# EAGLE design a101-fader (EAGLE 7.5.1)
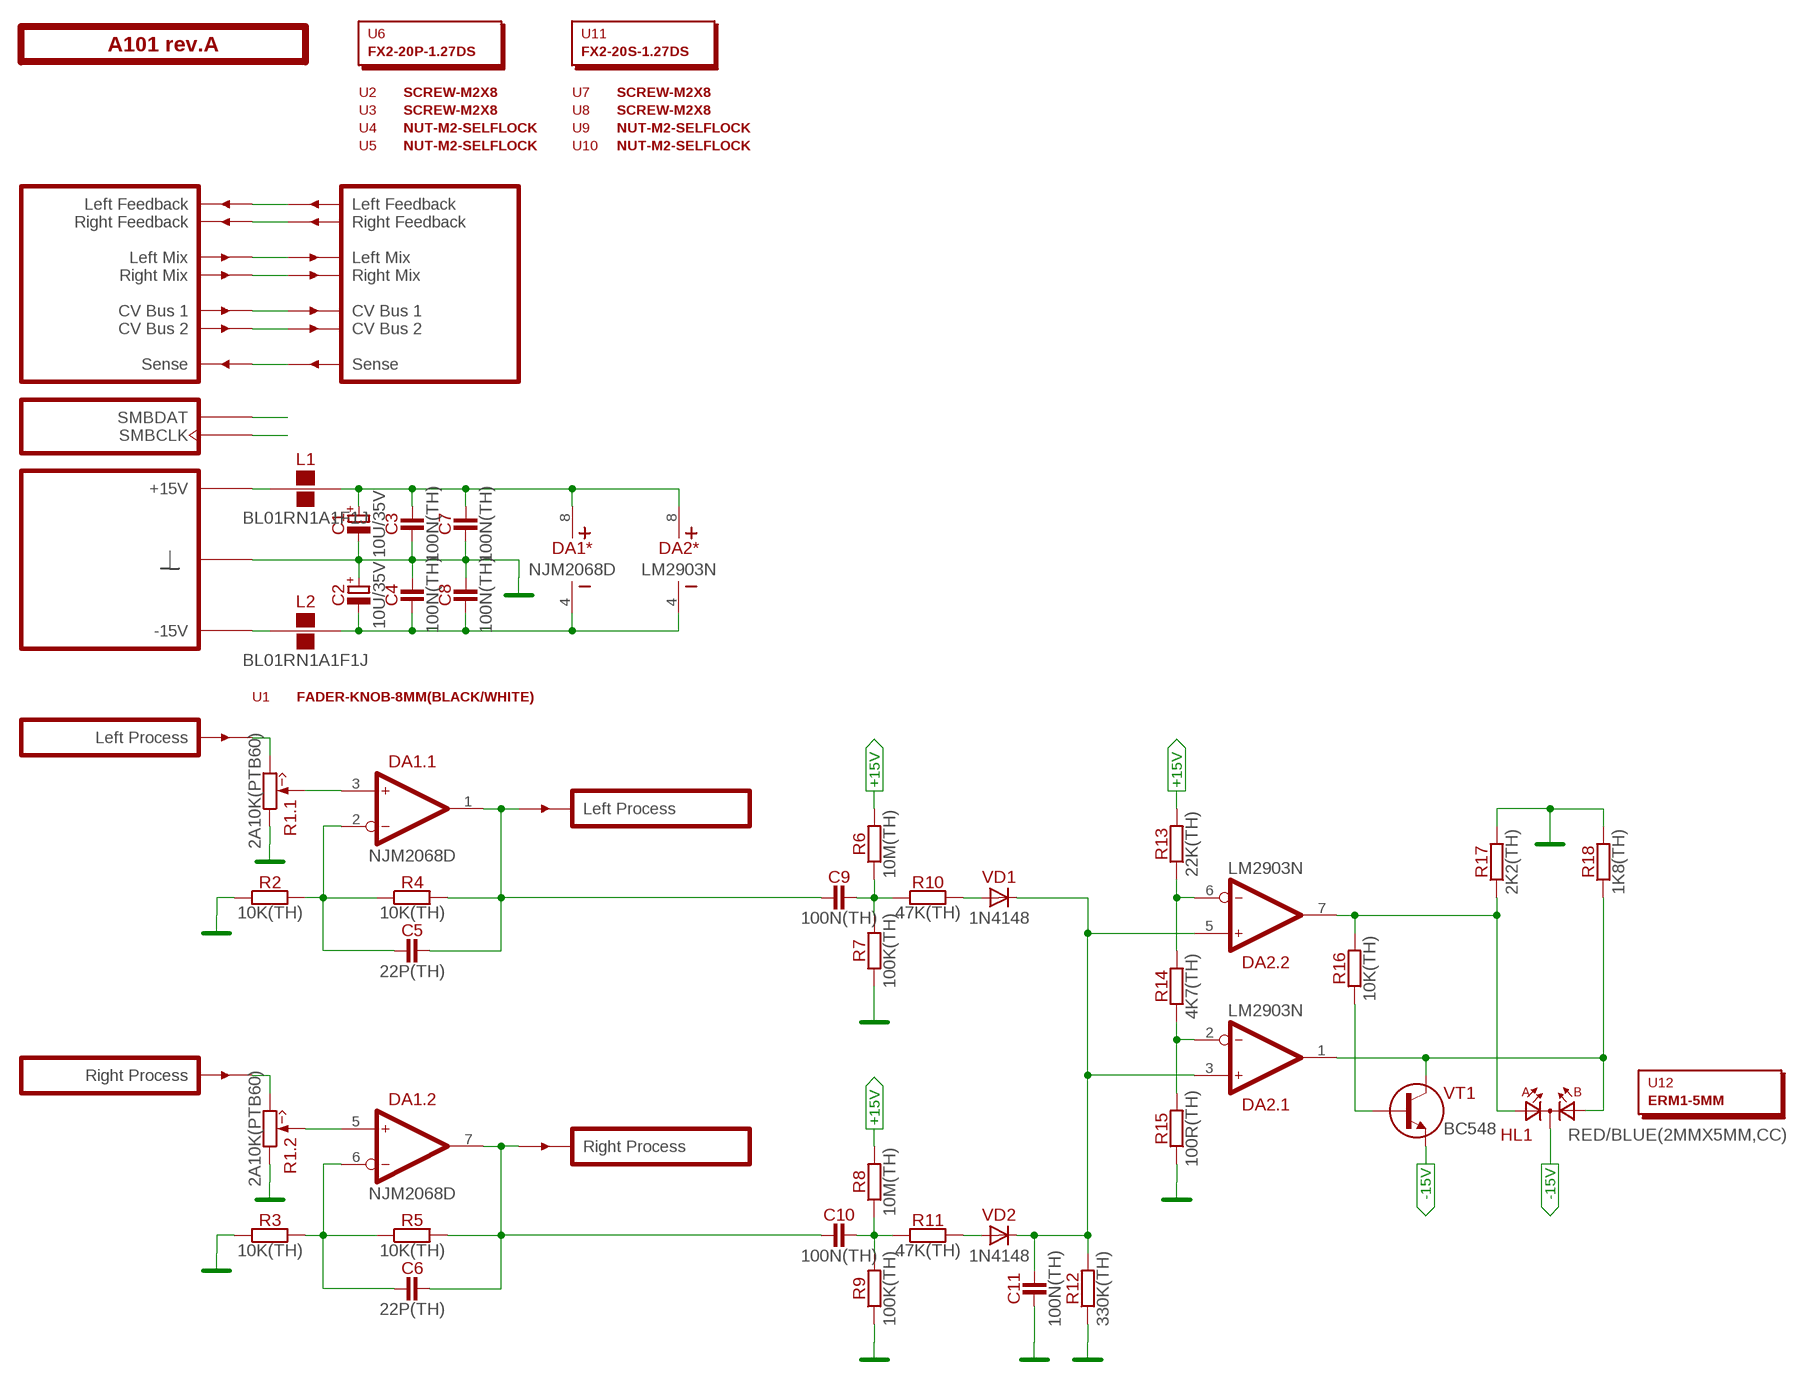
[diagram p0: schematic, sheet 1]

## Parts
C1  10U/35V  [E2-5]
C2  10U/35V  [E2-5]
C3  100N(TH)  [C050-024X044]
C4  100N(TH)  [C050-024X044]
C5  22P(TH)  [C050-024X044]
C6  22P(TH)  [C050-024X044]
C7  100N(TH)  [C050-024X044]
C8  100N(TH)  [C050-024X044]
C9  100N(TH)  [C050-024X044]
C10  100N(TH)  [C050-024X044]
C11  100N(TH)  [C050-024X044]
DA1  NJM2068D  [DIP-8]
DA2  LM2903N  [DIP-8]
HL1  RED/BLUE(2MMX5MM,CC)  [LED2X5-3PIN]
L1  BL01RN1A1F1J  [BL01RN1A]
L2  BL01RN1A1F1J  [BL01RN1A]
PCB1  A101 rev.A  ST2-BOARD-50  [ST2-BOARD-50]
R1  2A10K(PTB60)  [PTB6044]
R2  10K(TH)  [R-0207/10]
R3  10K(TH)  [R-0207/10]
R4  10K(TH)  [R-0207/10]
R5  10K(TH)  [R-0207/10]
R6  10M(TH)  [R-0207/10]
R7  100K(TH)  [R-0207/10]
R8  10M(TH)  [R-0207/10]
R9  100K(TH)  [R-0207/10]
R10  47K(TH)  [R-0207/10]
R11  47K(TH)  [R-0207/10]
R12  330K(TH)  [R-0207/10]
R13  22K(TH)  [R-0207/10]
R14  4K7(TH)  [R-0207/10]
R15  100R(TH)  [R-0207/10]
R16  10K(TH)  [R-0207/10]
R17  2K2(TH)  [R-0207/10]
R18  1K8(TH)  [R-0207/10]
U1  FADER-KNOB-8MM(BLACK/WHITE)  [EMPTY]
U2  SCREW-M2X8  [EMPTY]
U3  SCREW-M2X8  [EMPTY]
U4  NUT-M2-SELFLOCK  [EMPTY]
U5  NUT-M2-SELFLOCK  [EMPTY]
U6  FX2-20P-1.27DS  [EMPTY]
U7  SCREW-M2X8  [EMPTY]
U8  SCREW-M2X8  [EMPTY]
U9  NUT-M2-SELFLOCK  [EMPTY]
U10  NUT-M2-SELFLOCK  [EMPTY]
U11  FX2-20S-1.27DS  [EMPTY]
U12  ERM1-5MM  [EMPTY]
VD1  1N4148  [DO35-7]
VD2  1N4148  [DO35-7]
VT1  BC548  [TO92]

## Nets
+15V [power]: R6.2 R8.2 R13.2
-15V: HL1.K VT1.3(E)
GND: C1.- C2.+ C3.1 C4.2 C7.1 C8.2 C11.1 PCB1.B4'(GND) PCB1.B4(GND) PCB1.B5'(GND) PCB1.B5(GND) PCB1.B6'(GND) PCB1.B6(GND) PCB1.B7'(GND) PCB1.B7(GND) PCB1.B8'(GND) PCB1.B8(GND) R1.A1(.1:CCW) R1.B1(.2:CCW) R2.1 R3.1 R7.1 R9.1 R12.1 R15.1 R17.2 R18.2
N$1: PCB1.ALFBK'(LFBK') PCB1.ALFBK(LFBK)
N$2: PCB1.ARFBK'(RFBK') PCB1.ARFBK(RFBK)
N$3: PCB1.ALMIX'(LMIX') PCB1.ALMIX(LMIX)
N$4: PCB1.ARMIX'(RMIX') PCB1.ARMIX(RMIX)
N$5: PCB1.ACV1'(CV1') PCB1.ACV1(CV1)
N$6: PCB1.ACV2'(CV2') PCB1.ACV2(CV2)
N$7: PCB1.BSENSE'(SENSE') PCB1.BSENSE(SENSE)
N$8: PCB1.ASMBDAT'(SMBDAT) PCB1.ASMBDAT(SMBDAT)
N$9: PCB1.ASMBCLK'(SMBCLK) PCB1.ASMBCLK(SMBCLK)
N$10: PCB1.BINL(INL) R1.A3(.1:CW)
N$11: DA1.3(.1:IN+) R1.A2(.1:W)
N$12: C5.1 DA1.2(.1:IN-) R2.2 R4.1
N$14: PCB1.BINR(INR) R1.B3(.2:CW)
N$15: DA1.5(.2:IN+) R1.B2(.2:W)
N$16: C6.1 DA1.6(.2:IN-) R3.2 R5.1
N$18: C6.2 C10.1 DA1.7(.2:OUT) PCB1.BOUTR'(OUTR) R5.2
N$19: C5.2 C9.1 DA1.1(.1:OUT) PCB1.BOUTL'(OUTL) R4.2
N$20: C9.2 R6.1 R7.2 R10.1
N$21: R10.2 VD1.A
N$22: C10.2 R8.1 R9.2 R11.1
N$23: R11.2 VD2.A
N$24: C11.2 DA2.3(.1:IN+) DA2.5(.2:IN+) R12.2 VD1.C VD2.C
N$25: L1.1 PCB1.A+15'(P+15V) PCB1.A+15(P+15V) PCB1.B+15'(P+15V) PCB1.B+15(P+15V)
N$26: DA2.2(.1:IN-) R14.1 R15.2
N$27: DA2.6(.2:IN-) R13.1 R14.2
N$28: DA2.1(.1:OUT) HL1.A2 R18.1 VT1.1(C)
N$45: C1.+ C3.2 C7.2 DA1.8(*:V+) DA2.8(*:V+) L1.2
N$46: L2.1 PCB1.A-15'(P-15V) PCB1.A-15(P-15V) PCB1.B-15'(P-15V) PCB1.B-15(P-15V)
N$47: C2.- C4.1 C8.1 DA1.4(*:V-) DA2.4(*:V-) L2.2
N$48: DA2.7(.2:OUT) HL1.A1 R16.2 R17.1
N$49: R16.1 VT1.2(B)

## Library data of the parts
C1 C2 = capacitors-electrolytic:?; MOUSER: 647-USW1V100MDD
C3 C4 C7-C11 = capacitors:?; MOUSER: 81-RCER71H104K0A2H3B
C5 C6 = capacitors:?
DA1 = ic-jrc:NJM2068; MOUSER: 513-NJM2068D
DA2 = ic-fairchild:LM2903; MOUSER: 512-LM2903N
HL1 = optoelectronics:?(2MMX5MM,CC)
L1 L2 = inductors:BL01RN1A?; MOUSER: 81-BL01RN1A1F1J
PCB1 = module-footprints:ST2-BOARD-?
R1 = potentiometers:2**?(PTB60)
R2-R5 R16 = resistors:?; MOUSER: 71-RN55D-F-10K
R6 R8 R10-R12 R14 R17 R18 = resistors:?
R7 R9 = resistors:?; MOUSER: 71-RN55D-F-100K
R13 = resistors:?; MOUSER: 71-CCF0722K0GKE36
R15 = resistors:?; MOUSER: 71-RN55D-F-100/R
U1-U5 U7-U10 = hardware:*?
U6 = hardware:?; MOUSER: 798-FX2-20P-1.27DS71
U11 = hardware:?; MOUSER: 798-FX2-20S-1.27DS71
U12 = hardware:?
VD1 VD2 = diodes:?; MOUSER: 583-1N4148-T
VT1 = transistors-npn:?

## Board
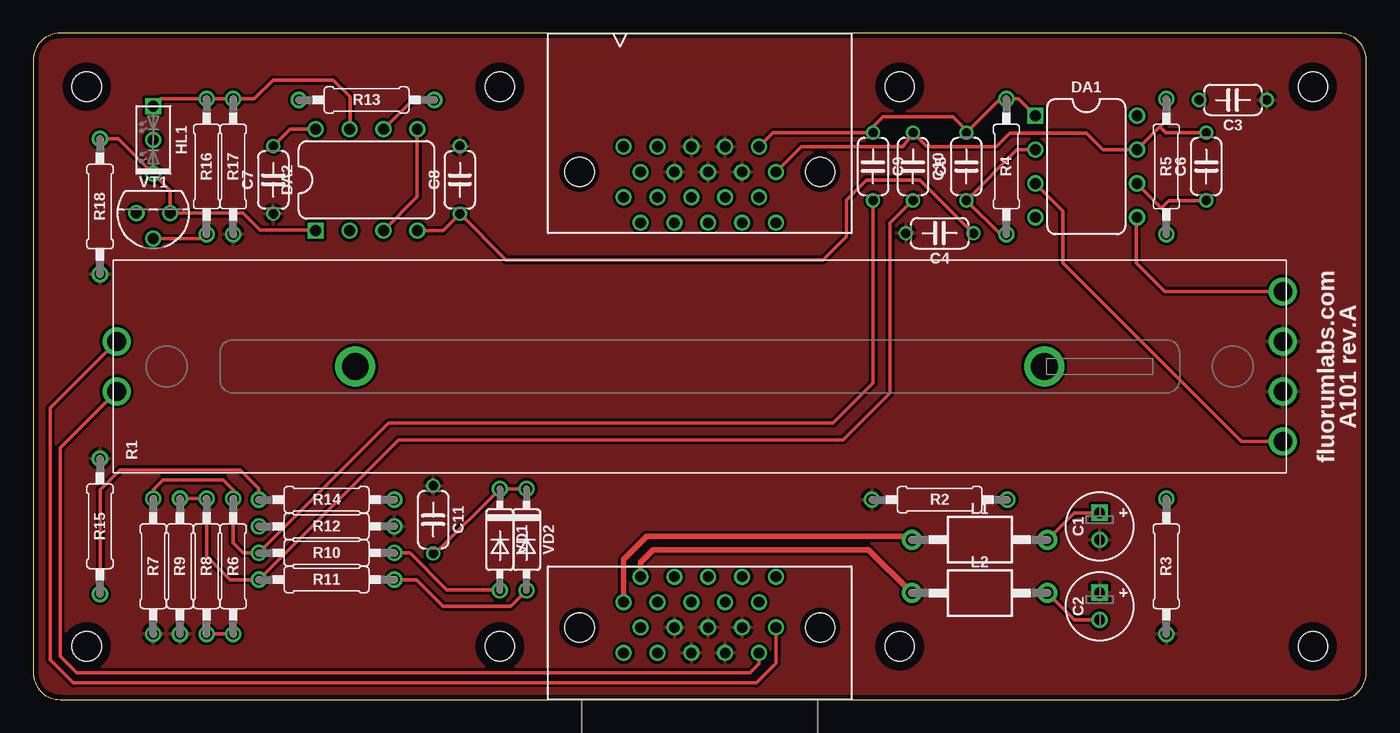
[diagram p1: board, top side]
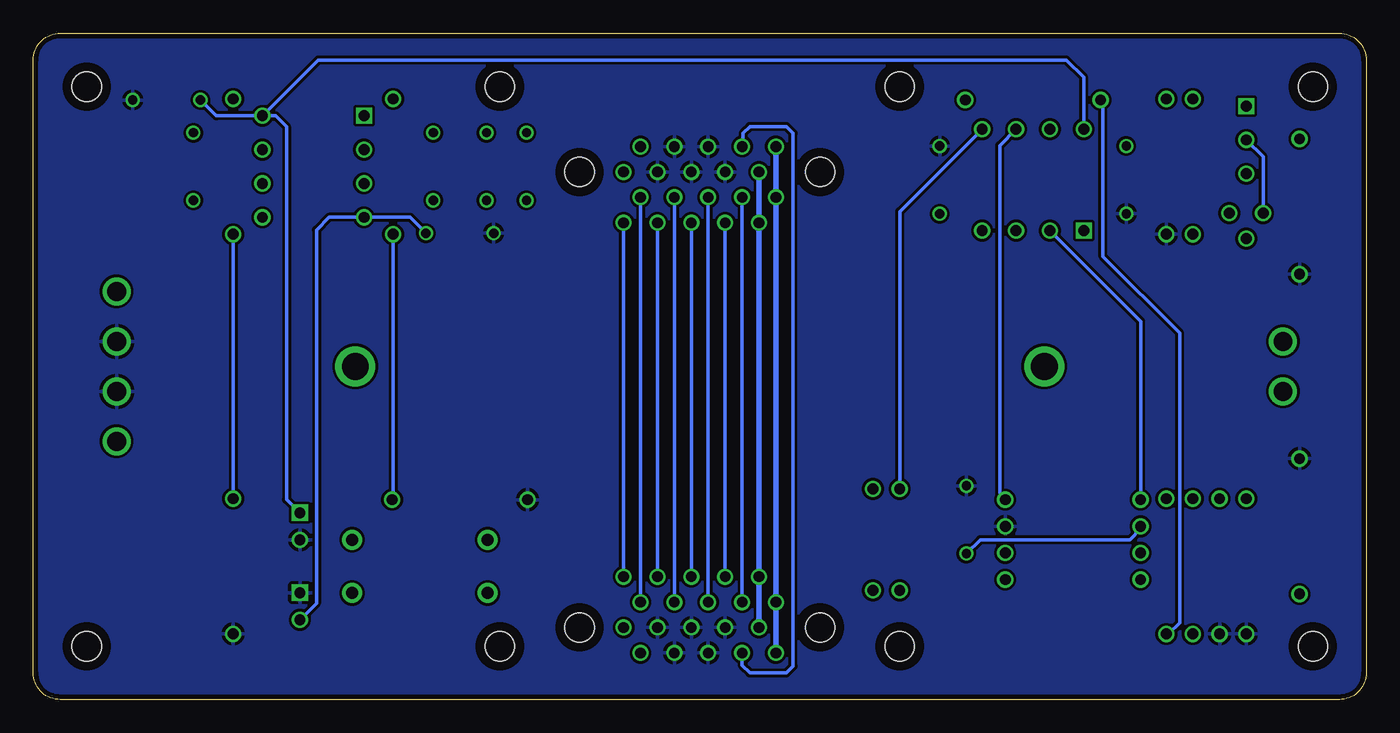
[diagram p2: board, bottom side, seen from below]

Size 100 x 50 mm. Coordinates in mm from the lower left corner, seen from the top.
Outline: 0,48 0,2 arc90 2,0 98,0 arc90 100,2 100,48 arc90 98,50 2,50 arc90 0,48
Copper layers (1*16): Top 0.0356mm / dielectric 1.5011mm / Bottom 0.0356mm
Design rules "sonictrain": minimum track width 6mil, minimum drill 13mil, track to track 8mil, track to pad 8mil, pad to pad 6mil, via to via 6mil, smd to smd 6mil, copper to edge 15mil, drill to drill 6mil, minimum pad ring 7mil, minimum via ring 7mil, stop-mask expansion 3mil, vias tented up to drill 25mil, thermal gap 10mil

### Footprints (pad centres in the part's own frame; a part is rotated, then mirrored left to right if it is on the bottom)
E2-5 = drill 0.813 square: + -1.016,0 | drill 0.813: - 1.016,0
C050-024X044 = drill 0.7: 1 -2.54,0; 2 2.54,0
DIP-8 = drill 0.813 square: 1 -3.81,-3.81 | drill 0.813: 2 -1.27,-3.81; 3 1.27,-3.81; 4 3.81,-3.81; 5 3.81,3.81; 6 1.27,3.81; 7 -1.27,3.81; 8 -3.81,3.81
LED2X5-3PIN = drill 0.813 square: A1 -2.54,0 | drill 0.813: A2 2.54,0; K 0,0
BL01RN1A = drill 0.9 pad 1.5: 1 -5.08,0; 2 5.08,0
ST2-BOARD-50 = drill 0.8: A+15 44.285,7.31; A+15' 44.285,37.69; A-15 45.555,9.215; A-15' 45.555,35.785; ACV1 51.905,7.31; ACV1' 51.905,37.69; ACV2 53.175,9.215; ACV2' 53.175,35.785; ALFBK 49.365,7.31; ALFBK' 49.365,37.69; ALMIX 46.825,7.31; ALMIX' 46.825,37.69; ARFBK 50.635,9.215; ARFBK' 50.635,35.785; ARMIX 48.095,9.215; ARMIX' 48.095,35.785; ASMBCLK 55.715,9.215; ASMBCLK' 55.715,35.785; ASMBDAT 54.445,7.31; ASMBDAT' 54.445,37.69; B4 48.095,5.405; B4' 48.095,39.595; B5 49.365,3.5; B5' 49.365,41.5; B6 50.635,5.405; B6' 50.635,39.595; B7 51.905,3.5; B7' 51.905,41.5; B8 53.175,5.405; B8' 53.175,39.595; B+15 44.285,3.5; B+15' 44.285,41.5; B-15 45.555,5.405; B-15' 45.555,39.595; BINL 54.445,3.5; BINR 55.715,5.405; BOUTL' 54.445,41.5; BOUTR' 55.715,39.595; BSENSE 46.825,3.5; BSENSE' 46.825,41.5 | hole 2.2: 4,4; 4,46; 96,4; 96,46; 35,46; 65,46; 65,4; 35,4; 59.025,5.405; 40.975,5.405; 40.975,39.595; 59.025,39.595
PTB6044 = drill 1.4: A1 -1.875,-43.75; A2 -5.625,-43.75; A3 -1.875,43.75; B1 1.875,-43.75; B2 5.625,-43.75; B3 1.875,43.75 | drill 2: S$1 0,-25.85; S$2 0,25.85
R-0207/10 = drill 0.813: 1 -5.08,0; 2 5.08,0
DO35-7 = drill 0.813: A 3.81,0; C -3.81,0
TO92 = drill 0.813: 1 -1.27,0; 2 0,1.905; 3 1.27,0

### Placement (x,y rotation side)
C1  80,13 270 top
C2  80,7 270 top
C3  90,45 180 top
C4  68,35 180 top
C5  70,40 90 top
C6  88,40 90 top
C7  18,39 90 top
C8  32,39 90 top
C9  63,40 270 top
C10  66,40 270 top
C11  30,13.5 270 top
DA1  79,40 270 top
DA2  25,39 0 top
HL1  9,42 270 top
L1  71,12 0 top
L2  71,8 0 top
PCB1  0,0 0 top
R1  2*A10K(PTB60)  [PTB6044]  50,25 90 top
R2  68,15 0 top
R3  85,10 90 top
R4  73,40 90 top
R5  85,40 90 top
R6  15,10 270 top
R7  9,10 90 top
R8  13,10 270 top
R9  11,10 90 top
R10  22,11 0 top
R11  22,9 0 top
R12  22,13 180 top
R13  25,45 180 top
R14  22,15 0 top
R15  5,13 270 top
R16  13,40 90 top
R17  15,40 270 top
R18  5,37 270 top
U1  3,-154 0 top  (outside the outline)
U2  28,-174 0 top  (outside the outline)
U3  31,-174 0 top  (outside the outline)
U4  34,-174 0 top  (outside the outline)
U5  37,-174 0 top  (outside the outline)
U6  40,-174 0 top  (outside the outline)
U7  43,-174 0 top  (outside the outline)
U8  46,-174 0 top  (outside the outline)
U9  49,-174 0 top  (outside the outline)
U10  52,-174 0 top  (outside the outline)
U11  55,-174 0 top  (outside the outline)
U12  58,-174 0 top  (outside the outline)
VD1  35,12 270 top
VD2  37,12 270 top
VT1  9,36.5 180 top

### Tracks (layer width: path | path; a pad name or v marks a point on that pad's centre or on a via)
+15V
  Top 0.254: R8.2 R6.2
  Bottom 0.254: R6.2 14.83,4.92 14,5.75 14,27.5 19.75,33.25 19.75,44.83 R13.2
-15V
  Bottom 0.254: VT1.3 7.73,40.73 HL1.K
GND
  pour Bottom: 0,50 100,50 100,0 0,0
  pour Top: 0,50 100,50 100,0 0,0
N$1
  Bottom 0.254: PCB1.ALFBK' PCB1.ALFBK
N$2
  Bottom 0.254: PCB1.ARFBK PCB1.ARFBK'
N$3
  Bottom 0.254: PCB1.ALMIX' PCB1.ALMIX
N$4
  Bottom 0.254: PCB1.ARMIX PCB1.ARMIX'
N$5
  Bottom 0.254: PCB1.ACV1' PCB1.ACV1
N$6
  Bottom 0.254: PCB1.ACV2 PCB1.ACV2'
N$7
  Bottom 0.254: PCB1.BSENSE 46.83,2.58 46.25,2 43.5,2 43,2.5 43,42.5 43.5,43 46.25,43 46.75,42.5 46.75,41.58 PCB1.BSENSE'
N$8
  Bottom 0.254: PCB1.ASMBDAT' PCB1.ASMBDAT
N$9
  Bottom 0.254: PCB1.ASMBCLK PCB1.ASMBCLK'
N$10
  Top 0.254: PCB1.BINL 54.45,2.69 53.75,2 3.25,2 2,3.25 2,18.88 R1.A3
N$11
  Top 0.254: R1.A2 90.62,19.38 77.25,32.75 77.25,36.67 DA1.3
N$12
  Top 0.254: DA1.2 73.81,41.27 C5.1 72.54,34.92 R4.1
  Bottom 0.254: R4.1 73,15.08 R2.2
N$14
  Top 0.254: PCB1.BINR 55.72,2.71 54.25,1.25 3,1.25 1.25,3 1.25,21.88 R1.B3
N$15
  Top 0.254: R1.B2 84.88,30.62 82.75,32.75 82.75,36.13 DA1.5
N$16
  Top 0.254: R5.1 85,36.54 84.64,36.9 | 84.64,36.9 DA1.6 | C6.1 85.21,37.46 84.64,36.9
  Bottom 0.254: R5.1 R3.2
N$18
  Top 0.254: R5.2 85,43.46 84.52,42.98 | 84.52,42.98 DA1.7 80.23,41.27 79,42.5 73.25,42.5 72.25,41.5 67.04,41.5 C10.1 66,42.5 65.25,41.5 57.62,41.5 PCB1.BOUTR' | C6.2 84.96,42.54 84.52,42.98
N$19
  Top 0.254: PCB1.BOUTL' 55.48,42.54 C9.1 63,43 63.75,43.75 69,43.75 69.75,43 69.75,42.79 C5.2 72.54,45.08 R4.2 73.92,45.08 DA1.1
N$20
  Top 0.254: R7.2 9,15.75 9.75,16.5 14.25,16.5 15,15.75 R6.1 15,11.75 15.75,11 R10.1 26.67,20.75 60,20.75 63,23.75 C9.2
N$21
  Top 0.254: R10.2 28.25,11 31,8.25 34.94,8.25 VD1.A
N$22
  Top 0.254: R9.2 R8.1 13,10.75 14.75,9 R11.1 27.42,19.5 60.75,19.5 64.25,23 64.25,35.75 65.96,37.46 C10.2
N$23
  Top 0.254: R11.2 28.75,9 30.75,7 35.81,7 VD2.A
N$24
  Top 0.254: DA2.5 28.81,37.73 DA2.3 | VD2.C VD1.C 30.15,10.96 C11.2
  Bottom 0.254: R12.2 16.92,12.83 17.75,12 28.96,12 C11.2 | VD1.C 35,36.62 DA2.5
N$25
  Top 0.406: PCB1.A+15 44.28,10.54 46,12.25 65.67,12.25 L1.1
  Bottom 0.406: PCB1.B+15 PCB1.A+15 PCB1.A+15' PCB1.B+15'
N$26
  Top 0.254: R14.1 16.92,15.83 15.5,17.25 6.5,17.25 5,15.75 R15.2
  Bottom 0.254: R14.1 16.92,28.38 DA2.2
N$27
  Top 0.254: R13.1 28.46,45 DA2.6
  Bottom 0.254: R14.2 27.08,15.08 27.5,15.5 27.5,41.58 DA2.6
N$28
  Top 0.254: R18.1 6.38,42.08 HL1.A2 10.27,38.19 VT1.1 15.75,36.5 17,35.25 21.13,35.25 DA2.1
N$45
  Top 0.254: DA2.8 19.27,42.81 C7.2 | C1.+ 78.1,14.02 L1.2
  Bottom 0.254: DA1.8 86.27,43.81 C3.2 | DA1.8 81.81,43.81 81,43 81,15.02 C1.+ | DA2.8 21.19,46.69 22.5,48 78.62,48 DA1.8
N$46
  Top 0.406: PCB1.A-15 45.55,10.3 46.5,11.25 62.67,11.25 L2.1
  Bottom 0.406: PCB1.B-15' PCB1.A-15' PCB1.A-15 PCB1.B-15
N$47
  Top 0.254: DA2.4 30.73,35.19 C8.1 35.46,33 59.25,33 61,34.75 61,37.5 62.5,39 66.5,39 70.5,35 C4.1 | C2.- 78.1,5.98 L2.2
  Bottom 0.254: C4.1 71.73,36.19 DA1.4 77.81,36.19 78.75,35.25 78.75,7.23 C2.-
N$48
  Top 0.254: HL1.A1 9.54,45.08 R16.2 R17.1 16.58,45.08 18,46.5 22.5,46.5 23.75,45.25 23.75,42.83 DA2.7
N$49
  Top 0.254: VT1.2 12.68,34.59 R16.1